# Altium schematic sheet [2] IMU.SchDoc
size A4
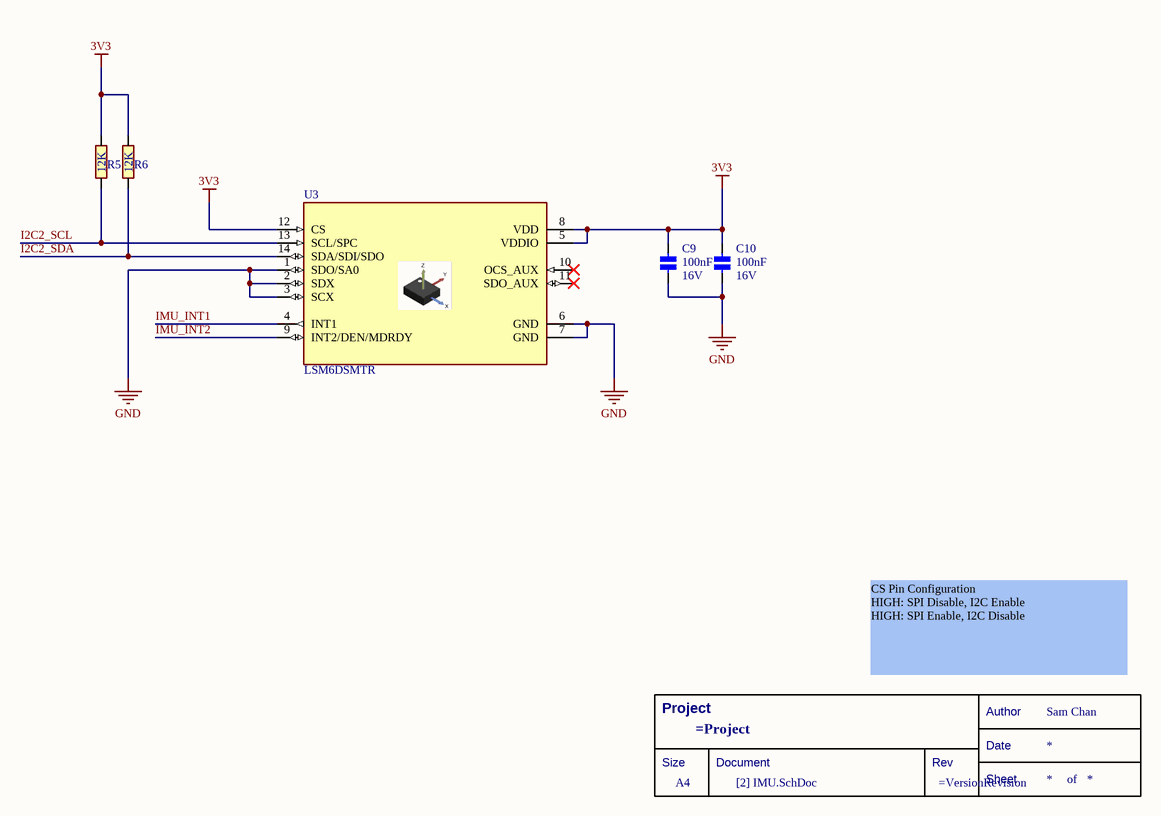
[diagram p0: [2] IMU.SchDoc]

## Parts
*  Title Block  (value not drawn)  (graphical)
C9  Voltage - Rated: 16V  [CAPC0402X05N]  (hidden comment: 100nF)
C10  Voltage - Rated: 16V  [CAPC0402X05N]  (hidden comment: 100nF)
R5  12K  [RESC0402X04N]
R6  12K  [RESC0402X04N]
U3  LSM6DSMTR  [LSM6DSMTR]

## Nets
3V3: C9.1 C10.1 R5.2 R6.2 U3.5(VDDIO) U3.8(VDD) U3.12(CS)
GND: C9.2 C10.2 U3.1(SDO/SA0) U3.2(SDX) U3.3(SCX) U3.6(GND) U3.7(GND)
I2C2_SCL: R5.1 U3.13(SCL/SPC)
I2C2_SDA: R6.1 U3.14(SDA/SDI/SDO)
IMU_INT1: U3.4(INT1)
IMU_INT2: U3.9(INT2/DEN/MDRDY)

Not connected (* = marked no-connect by the designer): U3 10(OCS_AUX)* 11(SDO_AUX)*

## Notes on the sheet
- CS Pin Configuration
  HIGH: SPI Disable, I2C Enable
  HIGH: SPI Enable, I2C Disable
- (in symbol Title Block) Project; Author; Sam Chan; Date; Size; Document; Rev; A4; Sheet; of

## Library data of the parts
* = Title Block: Standard Title Block
C9 C10 = CER 100NF 16V: CAP CER 0.1UF 16V X7R 0402; Manufacturer: Samsung Electro-Mechanics; Manufacturer Part Number: CL05B104KO5NNNC; Category: Capacitors; Supplier 1: LCSC; Supplier Part Number 1: C1525; Package / Case: 0402; Capacitance: 100nF
R5 R6 = RES 12K: RES SMD 12K OHM 1% 1/16W 0402; Manufacturer: YAGEO; Manufacturer Part Number: RC0402FR-0712KL; Category: Resistors; Package / Case: 0402; Supplier 1: LCSC; Supplier Part Number 1: C114760; Resistance: 12K
U3 = LSM6DSMTR: IMU ACCEL/GYRO I2C/SPI 14LGA; Manufacturer: STMicroelectronics; Categories: IMUs (Inertial Measurement Units); Case: 14-VFLGA Module; Manufacturer Part Number: LSM6DSMTR; Supplier 1: Digi-Key; Supplier Part Number 1: 497-16696-1-ND